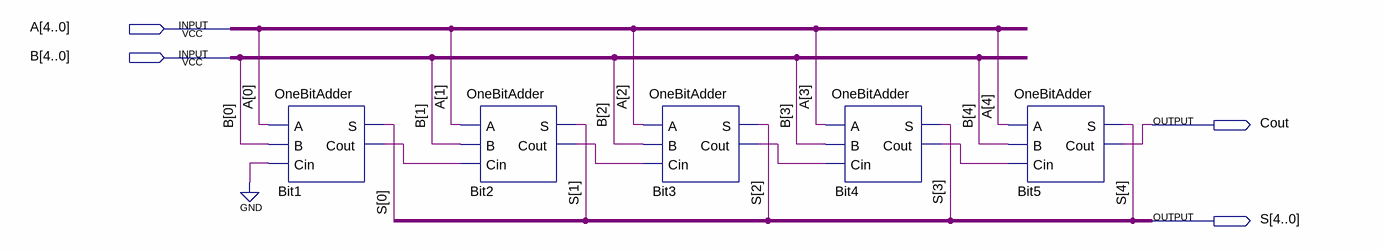
[diagram p0: schematic sheet]
// Quartus schematic FiveBitAdder.bdf as structural Verilog: 5 symbols, 4 pins
module FiveBitAdder (
  input  [4:0] A,
  input  [4:0] B,
  output Cout,
  output [4:0] S
);

  wire Bit1_cout, Bit2_cout, Bit3_cout, Bit4_cout;

  OneBitAdder Bit1 (.A(A[0]), .B(B[0]), .Cin(1'b0), .S(S[0]), .Cout(Bit1_cout));
  OneBitAdder Bit2 (.A(A[1]), .B(B[1]), .Cin(Bit1_cout), .S(S[1]), .Cout(Bit2_cout));
  OneBitAdder Bit3 (.A(A[2]), .B(B[2]), .Cin(Bit2_cout), .S(S[2]), .Cout(Bit3_cout));
  OneBitAdder Bit4 (.A(A[3]), .B(B[3]), .Cin(Bit3_cout), .S(S[3]), .Cout(Bit4_cout));
  OneBitAdder Bit5 (.A(A[4]), .B(B[4]), .Cin(Bit4_cout), .S(S[4]), .Cout(Cout));
endmodule
